# Altium schematic sheet STM32L151.SchDoc: lock
size A4; Author: george; Revision: V1.0; SheetNumber: 1
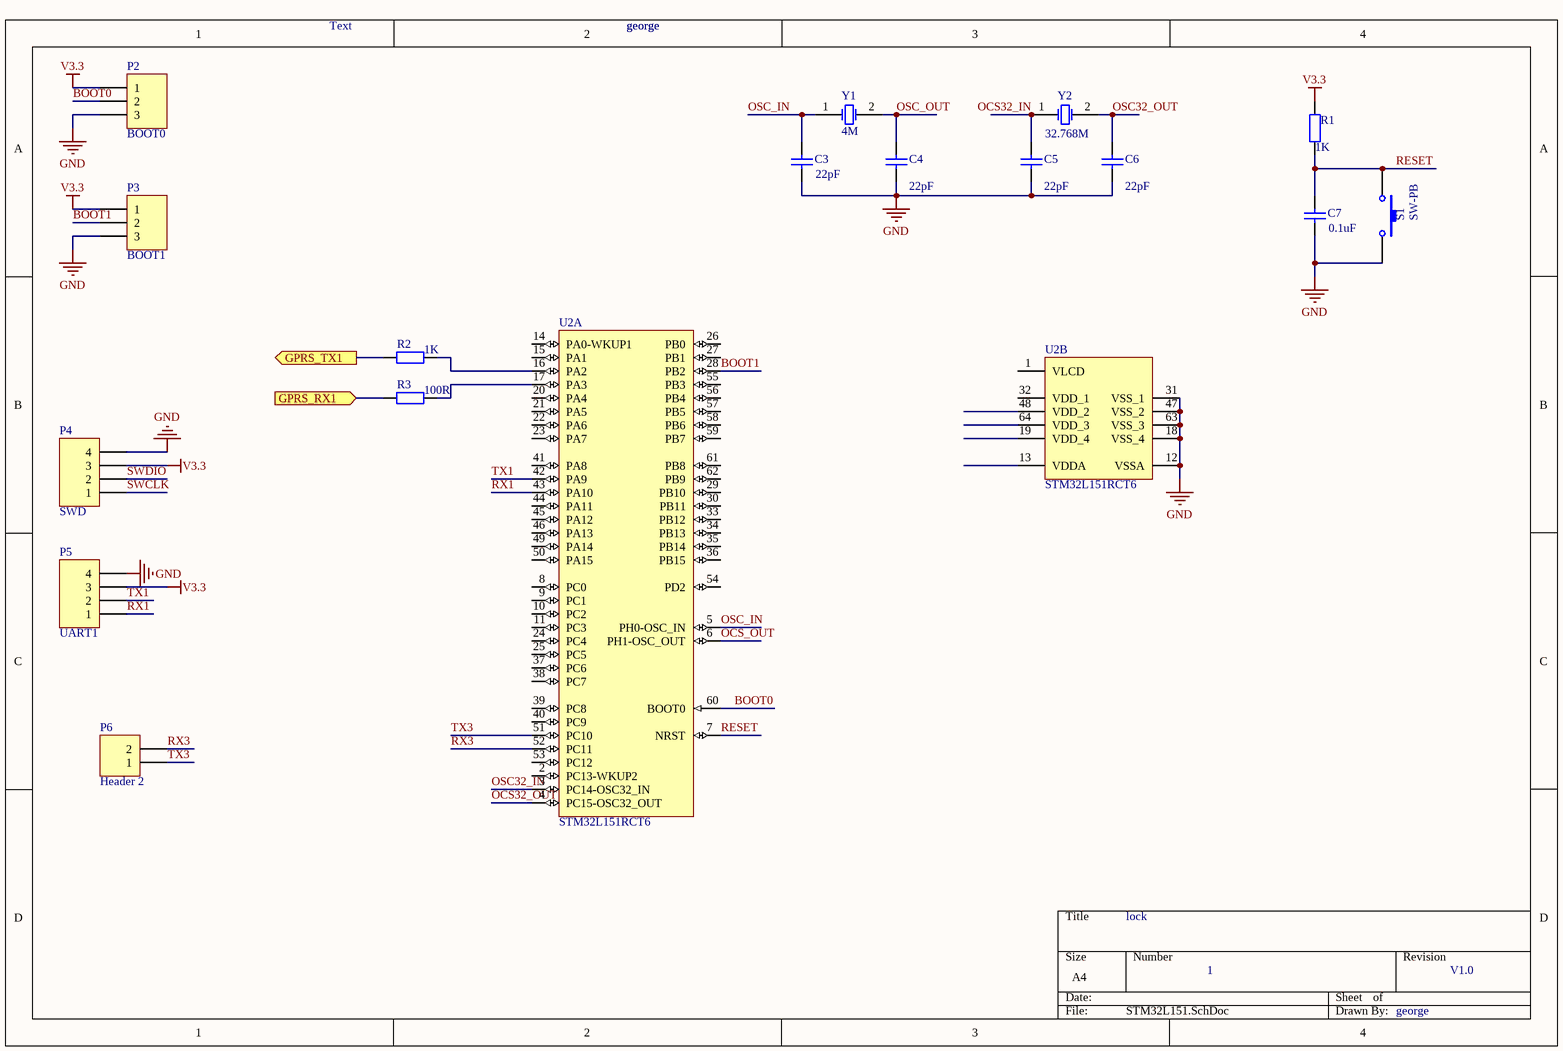
[diagram p0: STM32L151.SchDoc]

## Parts
C3  value 22pF  [RAD-0.3]  (hidden comment: Cap)
C4  value 22pF  [RAD-0.3]  (hidden comment: Cap)
C5  value 22pF  [RAD-0.3]  (hidden comment: Cap)
C6  value 22pF  [RAD-0.3]  (hidden comment: Cap)
C7  value 0.1uF  [RAD-0.3]  (hidden comment: Cap)
P2  BOOT0  [HDR1X3]
P3  BOOT1  [HDR1X3]
P4  SWD  [HDR1X4]
P5  UART1  [HDR1X4]
P6  Header 2  [HDR1X2]
R1  value 1K  [AXIAL-0.4]  (hidden comment: Res2)
R2  value 1K  [AXIAL-0.4]  (hidden comment: Res2)
R3  value 100R  [AXIAL-0.4]  (hidden comment: Res2)
S1  SW-PB  [SPST-2]
U2  STM32L151RCT6  [STM-LQFP64_N]  (parts A,B of 2)
Y1  4M  [R38]
Y2  32.768M  [R38]

## Ports
GPRS_RX1 (in), GPRS_TX1 (out)

## Nets
GND: C3.1 C4.1 C5.1 C6.1 C7.2 P2.3 P3.3 P4.4 P5.4 S1.2 U2.12(VSSA) U2.18(VSS_4) U2.31(VSS_1) U2.47(VSS_2) U2.63(VSS_3)
V3.3: P2.1 P3.1 P4.3 P5.3 R1.1
BOOT0: P2.2 U2.60(BOOT0)
BOOT1: P3.2 U2.28(PB2)
GPRS_RX1: R3.1 ; port GPRS_RX1
GPRS_TX1: R2.1 ; port GPRS_TX1
OCS32_OUT: U2.4(PC15-OSC32_OUT)
OCS_OUT: U2.6(PH1-OSC_OUT)
OSC32_IN: U2.3(PC14-OSC32_IN)
OSC32_OUT: C6.2 Y2.2(OSC2)
OSC_IN: C3.2 U2.5(PH0-OSC_IN) Y1.1(OSC1)
OSC_OUT: C4.2 Y1.2(OSC2)
RESET: C7.1 R1.2 S1.1 U2.7(NRST)
RX1: P5.1 U2.43(PA10)
RX3: P6.2 U2.52(PC11)
SWCLK: P4.1
SWDIO: P4.2
TX1: P5.2 U2.42(PA9)
TX3: P6.1 U2.51(PC10)
NetC5_2: C5.2 Y2.1(OSC1)
NetR2_2: R2.2 U2.16(PA2)
NetR3_2: R3.2 U2.17(PA3)

Not connected (* = marked no-connect by the designer): U2 1(VLCD) 2(PC13-WKUP2) 8(PC0) 9(PC1) 10(PC2) 11(PC3) 13(VDDA) 14(PA0-WKUP1) 15(PA1) 19(VDD_4) 20(PA4) 21(PA5) 22(PA6) 23(PA7) 24(PC4) 25(PC5) 26(PB0) 27(PB1) 29(PB10) 30(PB11) 32(VDD_1) 33(PB12) 34(PB13) 35(PB14) 36(PB15) 37(PC6) 38(PC7) 39(PC8) 40(PC9) 41(PA8) 44(PA11) 45(PA12) 46(PA13) 48(VDD_2) 49(PA14) 50(PA15) 53(PC12) 54(PD2) 55(PB3) 56(PB4) 57(PB5) 58(PB6) 59(PB7) 61(PB8) 62(PB9) 64(VDD_3)

## Notes on the sheet
- Text
- Labels drawn without touching a wire or pin: OCS32_IN

## Library data of the parts
C3-C7 = Cap: Capacitor; Published: 8-Jun-2000; LatestRevisionDate: 17-Jul-2002; LatestRevisionNote: Re-released for DXP Platform.; PackageReference: RAD-0.3; Publisher: Altium Limited; PackageDescription: Radial Cap, Thru-Hole; 2 Leads; 0.3 in Pin Spacing
P2 P3 = Header 3: Header, 3-Pin; LatestRevisionDate: 17-Jul-2002; LatestRevisionNote: Re-released for DXP Platform.; Publisher: Altium Limited
P4 P5 = Header 4: Header, 4-Pin; LatestRevisionDate: 17-Jul-2002; LatestRevisionNote: Re-released for DXP Platform.; Publisher: Altium Limited
P6 = Header 2: Header, 2-Pin; LatestRevisionDate: 17-Jul-2002; LatestRevisionNote: Re-released for DXP Platform.; Publisher: Altium Limited
R1-R3 = Res2: Resistor; Published: 8-Jun-2000; LatestRevisionDate: 17-Jul-2002; LatestRevisionNote: Re-released for DXP Platform.; PackageReference: AXIAL-0.4; Publisher: Altium Limited; PackageDescription: Axial Device, Thru-Hole; 2 Leads; 0.4 in Pin Spacing
S1 = SW-PB: Switch; Published: 24-Mar-1999; LatestRevisionDate: 17-Jul-2002; LatestRevisionNote: Re-released for DXP Platform.; PackageReference: SPST-2; Publisher: Altium Limited; PackageDescription: Switch; 2 Leads
U2 = STM32L151RCT6: ARM Cortex-M3 32-bit MCU, 256 KB Flash, 32 KB Internal RAM, 51 I/Os, 64-pin LQFP, -40 to 85 degC, Tray; Manufacturer: STMicroelectronics; D/A Converter: 2x12-bit (2 Channel); Data E2PROM nom (B): 8192; FLASH Size (Prog) (kB): 256; I/Os (High Current): 51; Internal RAM Size (kB): 32; Supply Voltage(Vcc) min (V): 1.65; DatasheetVersion: Rev. 3; PackageVersion: Rev. 4, 06/2013; PackageReference: LQFP64; PackageDescription: 64-Pin Low Profile Quad Flat Package, 10 x 10 mm Body, 0.5 mm Pitch; Core: ARM Cortex-M3; Operating Frequency(F) (Processor speed) (MHz): 32; Packing: Tray; Mounting Technology: Surface Mount; PartNumber: STM32L151RCT6; ComponentLink1Description: Manufacturer URL; ComponentLink1URL: http://www.st.com/web/en/home.html; ComponentLink2Description: Datasheet; ComponentLink2URL: http://www.st.com/st-web-ui/static/active/en/resource/technical/document/datasheet/DM00048356.pdf; ComponentLink3Description: Package Specification; ComponentLink3URL: http://www.st.com/st-web-ui/static/active/en/resource/technical/document/datasheet/DM00037051.pdf
Y1 Y2 = XTAL: Crystal Oscillator; Published: 8-Jun-2000; LatestRevisionDate: 17-Jul-2002; LatestRevisionNote: Re-released for DXP Platform.; PackageReference: R38; Publisher: Altium Limited; PackageDescription: Crystal, Thru-Hole; 2 Leads; Body 3.1 x 8.2 mm (Dia.xH)